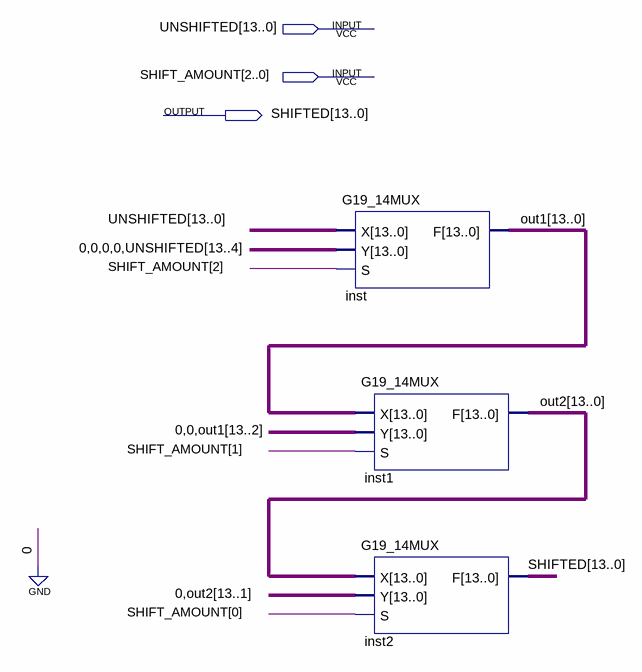
[diagram p0: schematic sheet]
// Quartus schematic G19_14MUX_COMPACT.bdf as structural Verilog: 3 symbols, 3 pins
module G19_14MUX_COMPACT (
  input  [13:0] UNSHIFTED,
  input  [2:0] SHIFT_AMOUNT,
  output [13:0] SHIFTED
);

  wire [13:0] out1, out2;

  G19_14MUX inst (.X(UNSHIFTED), .Y({4'b0000, UNSHIFTED[13:4]}), .S(SHIFT_AMOUNT[2]), .F(out1));
  G19_14MUX inst1 (.X(out1), .Y({2'b00, out1[13:2]}), .S(SHIFT_AMOUNT[1]), .F(out2));
  G19_14MUX inst2 (.X(out2), .Y({1'b0, out2[13:1]}), .S(SHIFT_AMOUNT[0]), .F(SHIFTED));
endmodule
